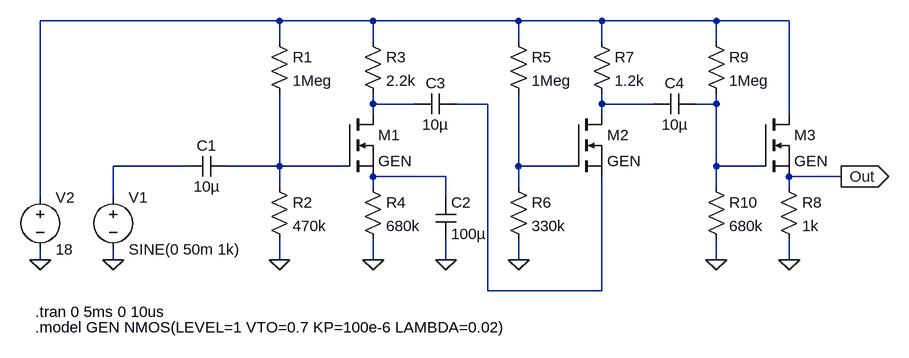
[diagram p0: schematic Draft2.asc]
Draft2.asc, the LTspice schematic file:
Version 4.1
SHEET 1 1300 680
WIRE 336 -160 -32 -160
WIRE 480 -160 336 -160
WIRE 704 -160 480 -160
WIRE 832 -160 704 -160
WIRE 1008 -160 832 -160
WIRE 1120 -160 1008 -160
WIRE 336 -128 336 -160
WIRE 480 -128 480 -160
WIRE 704 -128 704 -160
WIRE 832 -128 832 -160
WIRE 1008 -128 1008 -160
WIRE 480 -32 480 -48
WIRE 544 -32 480 -32
WIRE 656 -32 608 -32
WIRE 832 -32 832 -48
WIRE 912 -32 832 -32
WIRE 1008 -32 1008 -48
WIRE 1008 -32 976 -32
WIRE 480 -16 480 -32
WIRE 832 -16 832 -32
WIRE 1120 -16 1120 -160
WIRE 192 64 80 64
WIRE 336 64 336 -48
WIRE 336 64 256 64
WIRE 432 64 336 64
WIRE 704 64 704 -48
WIRE 784 64 704 64
WIRE 1008 64 1008 -32
WIRE 1072 64 1008 64
WIRE 592 80 480 80
WIRE 1200 80 1120 80
WIRE 336 96 336 64
WIRE 480 96 480 80
WIRE 704 96 704 64
WIRE 1008 96 1008 64
WIRE 1120 96 1120 80
WIRE -32 112 -32 -160
WIRE 80 112 80 64
WIRE 592 112 592 80
WIRE -32 208 -32 192
WIRE 80 208 80 192
WIRE 336 208 336 176
WIRE 480 208 480 176
WIRE 592 208 592 176
WIRE 704 208 704 176
WIRE 1008 208 1008 176
WIRE 1120 208 1120 176
WIRE 656 256 656 -32
WIRE 832 256 832 80
WIRE 832 256 656 256
FLAG 80 208 0
FLAG 336 208 0
FLAG 480 208 0
FLAG -32 208 0
FLAG 592 208 0
FLAG 704 208 0
FLAG 1008 208 0
FLAG 1120 208 0
FLAG 1200 80 Out
IOPIN 1200 80 Out
DATAFLAG 832 192 ""
SYMBOL voltage 80 96 R0
WINDOW 123 0 0 Left 0
WINDOW 39 0 0 Left 0
SYMATTR InstName V1
SYMATTR Value SINE(0 50m 1k)
SYMBOL cap 256 48 R90
WINDOW 0 0 32 VBottom 2
WINDOW 3 32 32 VTop 2
SYMATTR InstName C1
SYMATTR Value 10µ
SYMBOL res 320 80 R0
SYMATTR InstName R2
SYMATTR Value 470k
SYMATTR SpiceLine pwr=0.1
SYMBOL voltage -32 96 R0
WINDOW 123 0 0 Left 0
WINDOW 39 0 0 Left 0
SYMATTR InstName V2
SYMATTR Value 18
SYMBOL res 464 -144 R0
SYMATTR InstName R3
SYMATTR Value 2.2k
SYMATTR SpiceLine pwr=0.1
SYMBOL res 464 80 R0
SYMATTR InstName R4
SYMATTR Value 680k
SYMATTR SpiceLine pwr=0.1
SYMBOL res 320 -144 R0
SYMATTR InstName R1
SYMATTR Value 1Meg
SYMATTR SpiceLine pwr=0.1
SYMBOL cap 576 112 R0
SYMATTR InstName C2
SYMATTR Value 100µ
SYMBOL cap 608 -48 R90
WINDOW 0 0 32 VBottom 2
WINDOW 3 32 32 VTop 2
SYMATTR InstName C3
SYMATTR Value 10µ
SYMBOL res 688 -144 R0
SYMATTR InstName R5
SYMATTR Value 1Meg
SYMATTR SpiceLine pwr=0.1
SYMBOL res 688 80 R0
SYMATTR InstName R6
SYMATTR Value 330k
SYMATTR SpiceLine pwr=0.1
SYMBOL res 816 -144 R0
SYMATTR InstName R7
SYMATTR Value 1.2k
SYMATTR SpiceLine pwr=0.1
SYMBOL cap 976 -48 R90
WINDOW 0 0 32 VBottom 2
WINDOW 3 32 32 VTop 2
SYMATTR InstName C4
SYMATTR Value 10µ
SYMBOL res 1104 80 R0
SYMATTR InstName R8
SYMATTR Value 1k
SYMATTR SpiceLine pwr=0.1
SYMBOL res 992 -144 R0
SYMATTR InstName R9
SYMATTR Value 1Meg
SYMATTR SpiceLine pwr=0.1
SYMBOL res 992 80 R0
SYMATTR InstName R10
SYMATTR Value 680k
SYMATTR SpiceLine pwr=0.1
SYMBOL nmos 432 -16 R0
SYMATTR InstName M1
SYMATTR Value GEN
SYMBOL nmos 784 -16 R0
SYMATTR InstName M2
SYMATTR Value GEN
SYMBOL nmos 1072 -16 R0
SYMATTR InstName M3
SYMATTR Value GEN
TEXT -40 288 Left 2 !.tran 0 5ms 0 10us
TEXT -40 312 Left 2 !.model GEN NMOS(LEVEL=1 VTO=0.7 KP=100e-6 LAMBDA=0.02)

The netlist it stands for:
* Draft2.asc
V1 N006 0 SINE(0 50m 1k)
C1 N007 N006 10µ
R2 N007 0 470k pwr=0.1
V2 N001 0 18
R3 N001 N002 2.2k pwr=0.1
R4 N009 0 680k pwr=0.1
R1 N001 N007 1Meg pwr=0.1
C2 N009 0 100µ
C3 N003 N002 10µ
R5 N001 N008 1Meg pwr=0.1
R6 N008 0 330k pwr=0.1
R7 N001 N004 1.2k pwr=0.1
C4 N005 N004 10µ
R8 Out 0 1k pwr=0.1
R9 N001 N005 1Meg pwr=0.1
R10 N005 0 680k pwr=0.1
M1 N002 N007 N009 N009 GEN
M2 N004 N008 N003 N003 GEN
M3 N001 N005 Out Out GEN
.model NMOS NMOS
.model PMOS PMOS
.lib standard.mos
.tran 0 5ms 0 10us
.model GEN NMOS(LEVEL=1 VTO=0.7 KP=100e-6 LAMBDA=0.02)
.backanno
.end